# EAGLE schematic modul_template (EAGLE 7.4.0)
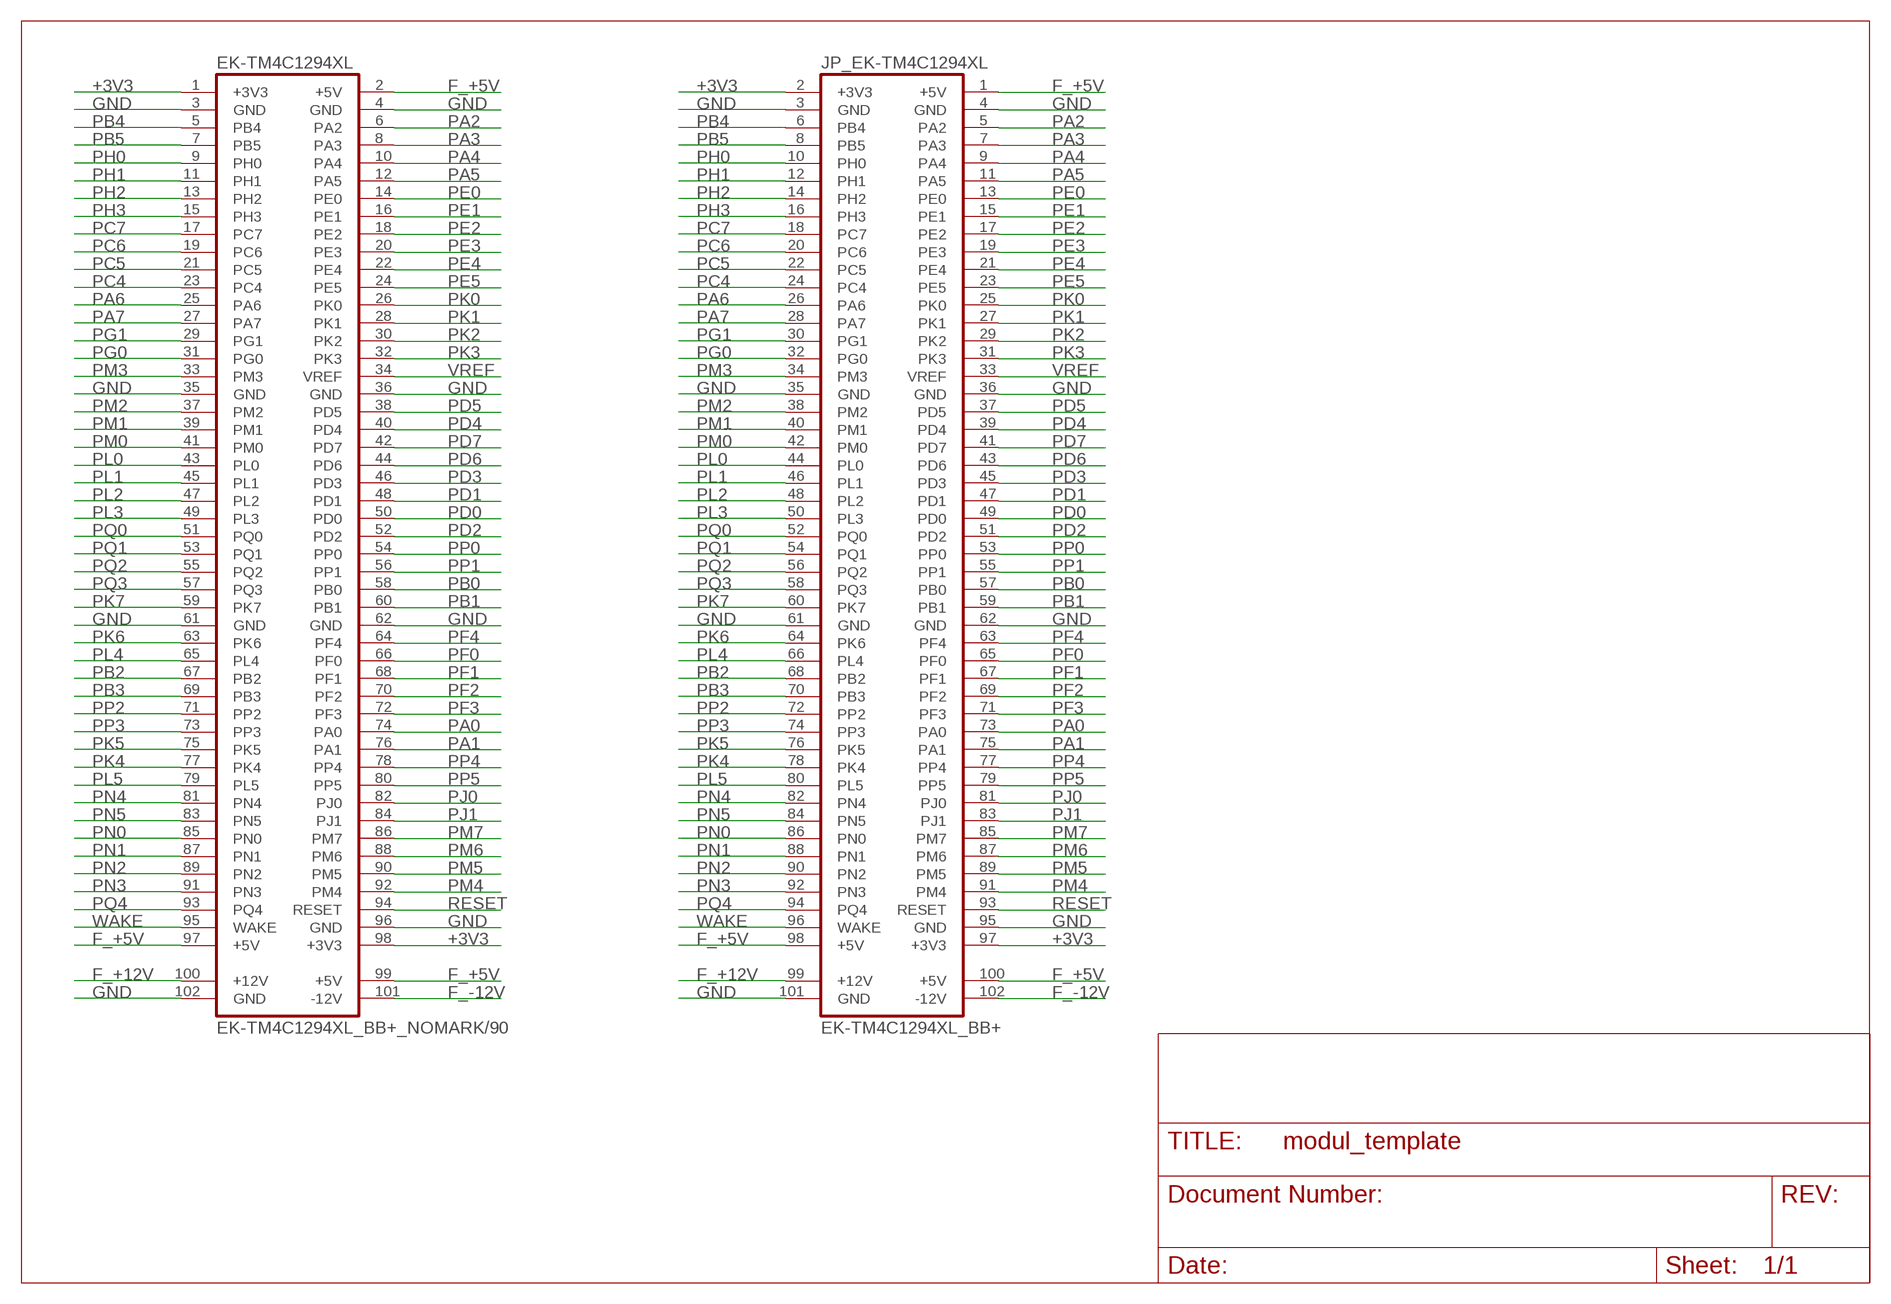
[diagram p0: schematic, sheet 1]

## Parts
EK-TM4C1294XL  EK-TM4C1294XL_BB+_NOMARK/90  [EK-TM4C1294XL_BB+_NOMARK/90]
JP_EK-TM4C1294XL  EK-TM4C1294XL_BB+  [EK-TM4C1294XL_BB+]

## Nets
+3V3: EK-TM4C1294XL.1(+3V3) EK-TM4C1294XL.98(+3V3) JP_EK-TM4C1294XL.2(+3V3) JP_EK-TM4C1294XL.97(+3V3)
F_+5V: EK-TM4C1294XL.2(+5V) EK-TM4C1294XL.97(+5V) EK-TM4C1294XL.99(+5V) JP_EK-TM4C1294XL.1(+5V) JP_EK-TM4C1294XL.98(+5V) JP_EK-TM4C1294XL.100(+5V)
F_+12V: EK-TM4C1294XL.100(+12V) JP_EK-TM4C1294XL.99(+12V)
F_-12V: EK-TM4C1294XL.101(-12V) JP_EK-TM4C1294XL.102(-12V)
GND: EK-TM4C1294XL.3(GND) EK-TM4C1294XL.4(GND) EK-TM4C1294XL.35(GND) EK-TM4C1294XL.36(GND) EK-TM4C1294XL.61(GND) EK-TM4C1294XL.62(GND) EK-TM4C1294XL.96(GND) EK-TM4C1294XL.102(GND) JP_EK-TM4C1294XL.3(GND) JP_EK-TM4C1294XL.4(GND) JP_EK-TM4C1294XL.35(GND) JP_EK-TM4C1294XL.36(GND) JP_EK-TM4C1294XL.61(GND) JP_EK-TM4C1294XL.62(GND) JP_EK-TM4C1294XL.95(GND) JP_EK-TM4C1294XL.101(GND)
PA0: EK-TM4C1294XL.74(PA0) JP_EK-TM4C1294XL.73(PA0)
PA1: EK-TM4C1294XL.76(PA1) JP_EK-TM4C1294XL.75(PA1)
PA2: EK-TM4C1294XL.6(PA2) JP_EK-TM4C1294XL.5(PA2)
PA3: EK-TM4C1294XL.8(PA3) JP_EK-TM4C1294XL.7(PA3)
PA4: EK-TM4C1294XL.10(PA4) JP_EK-TM4C1294XL.9(PA4)
PA5: EK-TM4C1294XL.12(PA5) JP_EK-TM4C1294XL.11(PA5)
PA6: EK-TM4C1294XL.25(PA6) JP_EK-TM4C1294XL.26(PA6)
PA7: EK-TM4C1294XL.27(PA7) JP_EK-TM4C1294XL.28(PA7)
PB0: EK-TM4C1294XL.58(PB0) JP_EK-TM4C1294XL.57(PB0)
PB1: EK-TM4C1294XL.60(PB1) JP_EK-TM4C1294XL.59(PB1)
PB2: EK-TM4C1294XL.67(PB2) JP_EK-TM4C1294XL.68(PB2)
PB3: EK-TM4C1294XL.69(PB3) JP_EK-TM4C1294XL.70(PB3)
PB4: EK-TM4C1294XL.5(PB4) JP_EK-TM4C1294XL.6(PB4)
PB5: EK-TM4C1294XL.7(PB5) JP_EK-TM4C1294XL.8(PB5)
PC4: EK-TM4C1294XL.23(PC4) JP_EK-TM4C1294XL.24(PC4)
PC5: EK-TM4C1294XL.21(PC5) JP_EK-TM4C1294XL.22(PC5)
PC6: EK-TM4C1294XL.19(PC6) JP_EK-TM4C1294XL.20(PC6)
PC7: EK-TM4C1294XL.17(PC7) JP_EK-TM4C1294XL.18(PC7)
PD0: EK-TM4C1294XL.50(PD0) JP_EK-TM4C1294XL.49(PD0)
PD1: EK-TM4C1294XL.48(PD1) JP_EK-TM4C1294XL.47(PD1)
PD2: EK-TM4C1294XL.52(PD2) JP_EK-TM4C1294XL.51(PD2)
PD3: EK-TM4C1294XL.46(PD3) JP_EK-TM4C1294XL.45(PD3)
PD4: EK-TM4C1294XL.40(PD4) JP_EK-TM4C1294XL.39(PD4)
PD5: EK-TM4C1294XL.38(PD5) JP_EK-TM4C1294XL.37(PD5)
PD6: EK-TM4C1294XL.44(PD6) JP_EK-TM4C1294XL.43(PD6)
PD7: EK-TM4C1294XL.42(PD7) JP_EK-TM4C1294XL.41(PD7)
PE0: EK-TM4C1294XL.14(PE0) JP_EK-TM4C1294XL.13(PE0)
PE1: EK-TM4C1294XL.16(PE1) JP_EK-TM4C1294XL.15(PE1)
PE2: EK-TM4C1294XL.18(PE2) JP_EK-TM4C1294XL.17(PE2)
PE3: EK-TM4C1294XL.20(PE3) JP_EK-TM4C1294XL.19(PE3)
PE4: EK-TM4C1294XL.22(PE4) JP_EK-TM4C1294XL.21(PE4)
PE5: EK-TM4C1294XL.24(PE5) JP_EK-TM4C1294XL.23(PE5)
PF0: EK-TM4C1294XL.66(PF0) JP_EK-TM4C1294XL.65(PF0)
PF1: EK-TM4C1294XL.68(PF1) JP_EK-TM4C1294XL.67(PF1)
PF2: EK-TM4C1294XL.70(PF2) JP_EK-TM4C1294XL.69(PF2)
PF3: EK-TM4C1294XL.72(PF3) JP_EK-TM4C1294XL.71(PF3)
PF4: EK-TM4C1294XL.64(PF4) JP_EK-TM4C1294XL.63(PF4)
PG0: EK-TM4C1294XL.31(PG0) JP_EK-TM4C1294XL.32(PG0)
PG1: EK-TM4C1294XL.29(PG1) JP_EK-TM4C1294XL.30(PG1)
PH0: EK-TM4C1294XL.9(PH0) JP_EK-TM4C1294XL.10(PH0)
PH1: EK-TM4C1294XL.11(PH1) JP_EK-TM4C1294XL.12(PH1)
PH2: EK-TM4C1294XL.13(PH2) JP_EK-TM4C1294XL.14(PH2)
PH3: EK-TM4C1294XL.15(PH3) JP_EK-TM4C1294XL.16(PH3)
PJ0: EK-TM4C1294XL.82(PJ0) JP_EK-TM4C1294XL.81(PJ0)
PJ1: EK-TM4C1294XL.84(PJ1) JP_EK-TM4C1294XL.83(PJ1)
PK0: EK-TM4C1294XL.26(PK0) JP_EK-TM4C1294XL.25(PK0)
PK1: EK-TM4C1294XL.28(PK1) JP_EK-TM4C1294XL.27(PK1)
PK2: EK-TM4C1294XL.30(PK2) JP_EK-TM4C1294XL.29(PK2)
PK3: EK-TM4C1294XL.32(PK3) JP_EK-TM4C1294XL.31(PK3)
PK4: EK-TM4C1294XL.77(PK4) JP_EK-TM4C1294XL.78(PK4)
PK5: EK-TM4C1294XL.75(PK5) JP_EK-TM4C1294XL.76(PK5)
PK6: EK-TM4C1294XL.63(PK6) JP_EK-TM4C1294XL.64(PK6)
PK7: EK-TM4C1294XL.59(PK7) JP_EK-TM4C1294XL.60(PK7)
PL0: EK-TM4C1294XL.43(PL0) JP_EK-TM4C1294XL.44(PL0)
PL1: EK-TM4C1294XL.45(PL1) JP_EK-TM4C1294XL.46(PL1)
PL2: EK-TM4C1294XL.47(PL2) JP_EK-TM4C1294XL.48(PL2)
PL3: EK-TM4C1294XL.49(PL3) JP_EK-TM4C1294XL.50(PL3)
PL4: EK-TM4C1294XL.65(PL4) JP_EK-TM4C1294XL.66(PL4)
PL5: EK-TM4C1294XL.79(PL5) JP_EK-TM4C1294XL.80(PL5)
PM0: EK-TM4C1294XL.41(PM0) JP_EK-TM4C1294XL.42(PM0)
PM1: EK-TM4C1294XL.39(PM1) JP_EK-TM4C1294XL.40(PM1)
PM2: EK-TM4C1294XL.37(PM2) JP_EK-TM4C1294XL.38(PM2)
PM3: EK-TM4C1294XL.33(PM3) JP_EK-TM4C1294XL.34(PM3)
PM4: EK-TM4C1294XL.92(PM4) JP_EK-TM4C1294XL.91(PM4)
PM5: EK-TM4C1294XL.90(PM5) JP_EK-TM4C1294XL.89(PM5)
PM6: EK-TM4C1294XL.88(PM6) JP_EK-TM4C1294XL.87(PM6)
PM7: EK-TM4C1294XL.86(PM7) JP_EK-TM4C1294XL.85(PM7)
PN0: EK-TM4C1294XL.85(PN0) JP_EK-TM4C1294XL.86(PN0)
PN1: EK-TM4C1294XL.87(PN1) JP_EK-TM4C1294XL.88(PN1)
PN2: EK-TM4C1294XL.89(PN2) JP_EK-TM4C1294XL.90(PN2)
PN3: EK-TM4C1294XL.91(PN3) JP_EK-TM4C1294XL.92(PN3)
PN4: EK-TM4C1294XL.81(PN4) JP_EK-TM4C1294XL.82(PN4)
PN5: EK-TM4C1294XL.83(PN5) JP_EK-TM4C1294XL.84(PN5)
PP0: EK-TM4C1294XL.54(PP0) JP_EK-TM4C1294XL.53(PP0)
PP1: EK-TM4C1294XL.56(PP1) JP_EK-TM4C1294XL.55(PP1)
PP2: EK-TM4C1294XL.71(PP2) JP_EK-TM4C1294XL.72(PP2)
PP3: EK-TM4C1294XL.73(PP3) JP_EK-TM4C1294XL.74(PP3)
PP4: EK-TM4C1294XL.78(PP4) JP_EK-TM4C1294XL.77(PP4)
PP5: EK-TM4C1294XL.80(PP5) JP_EK-TM4C1294XL.79(PP5)
PQ0: EK-TM4C1294XL.51(PQ0) JP_EK-TM4C1294XL.52(PQ0)
PQ1: EK-TM4C1294XL.53(PQ1) JP_EK-TM4C1294XL.54(PQ1)
PQ2: EK-TM4C1294XL.55(PQ2) JP_EK-TM4C1294XL.56(PQ2)
PQ3: EK-TM4C1294XL.57(PQ3) JP_EK-TM4C1294XL.58(PQ3)
PQ4: EK-TM4C1294XL.93(PQ4) JP_EK-TM4C1294XL.94(PQ4)
RESET: EK-TM4C1294XL.94(RESET) JP_EK-TM4C1294XL.93(RESET)
VREF: EK-TM4C1294XL.34(VREF) JP_EK-TM4C1294XL.33(VREF)
WAKE: EK-TM4C1294XL.95(WAKE) JP_EK-TM4C1294XL.96(WAKE)

## Library data of the parts
EK-TM4C1294XL JP_EK-TM4C1294XL = ownparts:EK-TM4C1294XL_BB+